# EAGLE design flying-blind-tvc (EAGLE 9.7.0)
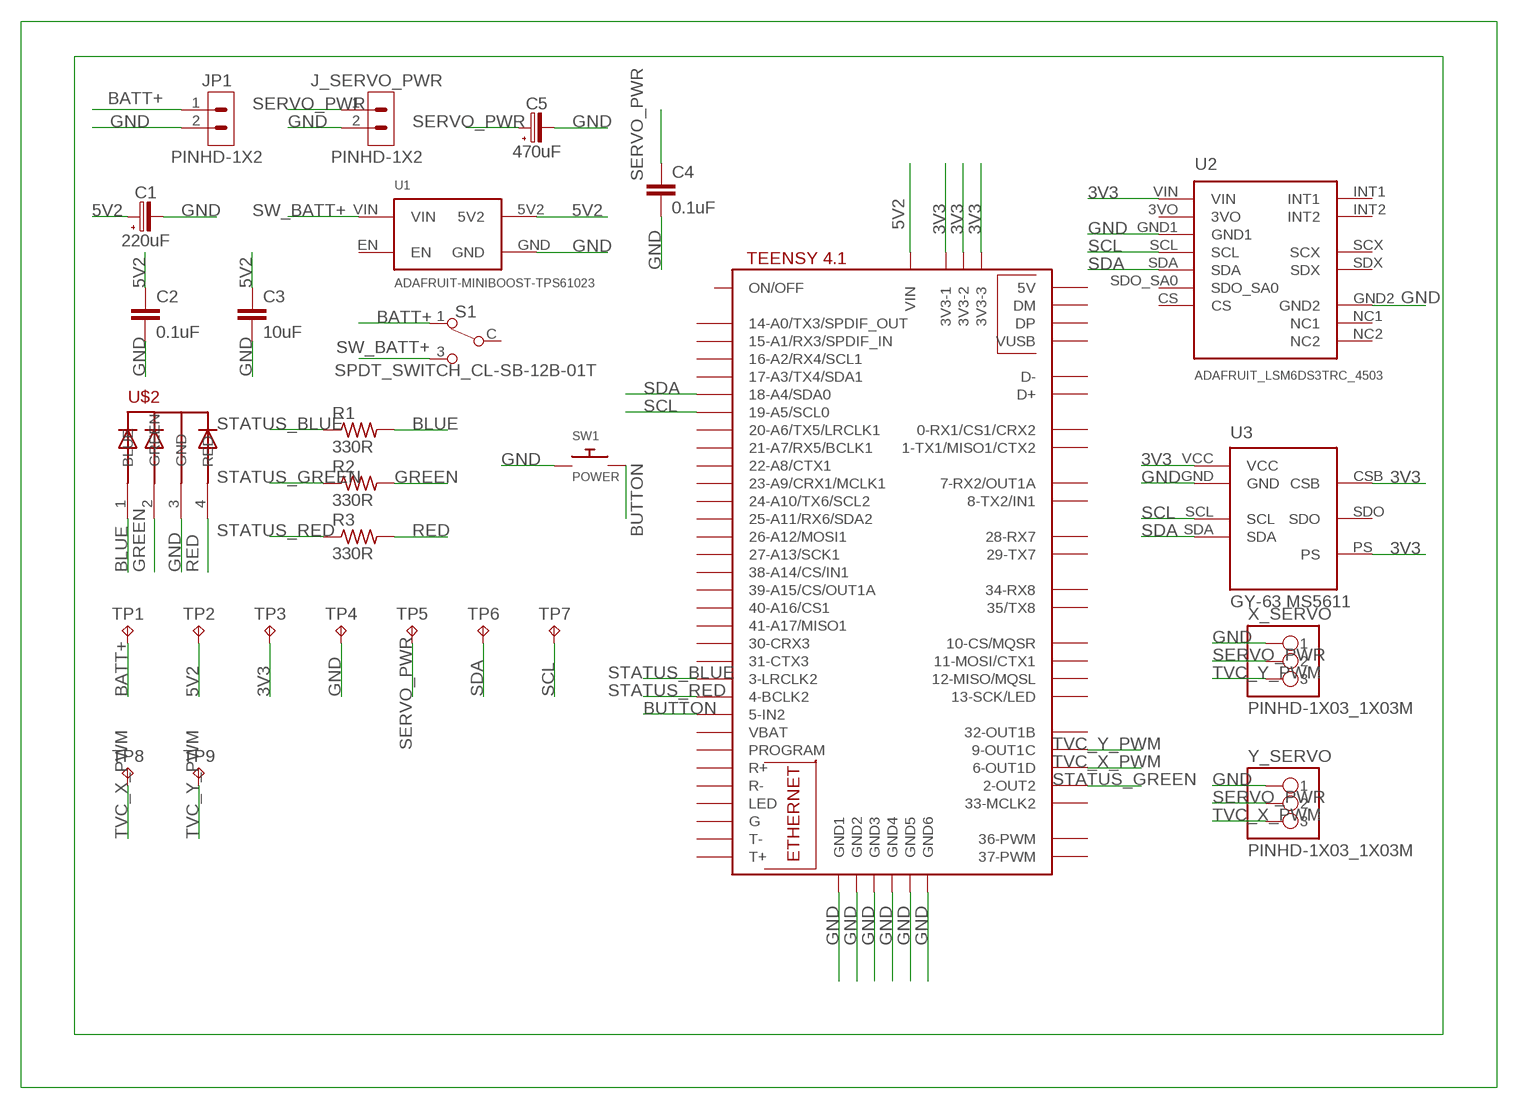
[diagram p0: schematic, sheet 1]

## Parts
C1  220uF  C-POLRADIAL-6.3MM-DIA  [CAPPRD250W80D630H800B]
C2  0.1uF  0.1UF-0402-16V-10%  [0402]
C3  10uF  10UF-0603-6.3V-20%  [0603]
C4  0.1uF  0.1UF-0402-16V-10%  [0402]
C5  470uF  C-POLRADIAL-6.3MM-DIA  [CAPPRD250W80D630H800B]
J_SERVO_PWR  PINHD-1X2  [1X02]
JP1  PINHD-1X2  [1X02]
R1  330R  R-US_R0805  [R0805]
R2  330R  R-US_R0805  [R0805]
R3  330R  R-US_R0805  [R0805]
S1  SPDT_SWITCH_CL-SB-12B-01T  [CL-SB-12B-01T]
SW1  POWER  SWITCH_PUSHBUTTONEVQ-PE  [TACT_PANA-EVQ]
TP1  TPTP127R  [TP127R]
TP2  TPTP127R  [TP127R]
TP3  TPTP127R  [TP127R]
TP4  TPTP127R  [TP127R]
TP5  TPTP127R  [TP127R]
TP6  TPTP127R  [TP127R]
TP7  TPTP127R  [TP127R]
TP8  TPTP127R  [TP127R]
TP9  TPTP127R  [TP127R]
U1  ADAFRUIT-MINIBOOST-TPS61023  [ADAFRUIT-MINIBOOST-TPS61023]
U2  ADAFRUIT_LSM6DS3TRC_4503  [ADAFRUIT_LSM6DS3TRC_4503]
U3  GY-63 MS5611  GY-63-MS5611  [GY-63-MS5611-7P]
U$1  TEENSY41  [TEENSY41]
U$2  5MMRGBLED  [LED5MMRGB]
X_SERVO  PINHD-1X03_1X03M  [1X03]
Y_SERVO  PINHD-1X03_1X03M  [1X03]

## Nets
3V3: TP3.TP U2.VIN U3.CSB U3.PS U3.VCC U$1.3V3-1 U$1.3V3-2 U$1.3V3-3
5V2: C1.1(+) C2.1 C3.1 TP2.TP U1.5V2 U$1.VIN
BATT+: JP1.1 S1.1(NC) TP1.TP
BLUE: R1.2 U$2.1(BLUE)
BUTTON: SW1.P$2 U$1.5-IN2
GND: C1.2(-) C2.2 C3.2 C4.2 C5.2(-) J_SERVO_PWR.2 JP1.2 SW1.P$1 TP4.TP U1.GND U2.GND1 U2.GND2 U3.GND U$1.GND1 U$1.GND2 U$1.GND3 U$1.GND4 U$1.GND5 U$1.GND6 U$2.3(GND) X_SERVO.1 Y_SERVO.1
GREEN: R2.2 U$2.2(GREEN)
RED: R3.2 U$2.4(RED)
SCL: TP7.TP U2.SCL U3.SCL U$1.19-A5/SCL0
SDA: TP6.TP U2.SDA U3.SDA U$1.18-A4/SDA0
SERVO_PWR: C4.1 C5.1(+) J_SERVO_PWR.1 TP5.TP X_SERVO.2 Y_SERVO.2
STATUS_BLUE: R1.1 U$1.3-LRCLK2
STATUS_GREEN: R2.1 U$1.2-OUT2
STATUS_RED: R3.1 U$1.4-BCLK2
SW_BATT+: S1.3(NO) U1.VIN
TVC_X_PWM: TP8.TP U$1.6-OUT1D Y_SERVO.3
TVC_Y_PWM: TP9.TP U$1.9-OUT1C X_SERVO.3
Unconnected: S1.C(COM) U1.EN U2.3VO U2.CS U2.INT1 U2.INT2 U2.NC1 U2.NC2 U2.SCX U2.SDO_SA0 U2.SDX U3.SDO U$1.0-RX1/CS1/CRX2 U$1.1-TX1/MISO1/CTX2 U$1.7-RX2/OUT1A U$1.8-TX2/IN1 U$1.10-CS\MQSR(10-CS/MQSR) U$1.11-MOSI/CTX1 U$1.12-MISO/MQSL U$1.13-SCK/LED U$1.14-A0/TX3/SPDIF_OUT U$1.15-A1/RX3/SPDIF_IN U$1.16-A2/RX4/SCL1 U$1.17-A3/TX4/SDA1 U$1.20-A6/TX5/LRCLK1 U$1.21-A7/RX5/BCLK1 U$1.22-A8/CTX1 U$1.23-A9/CRX1/MCLK1 U$1.24-A10/TX6/SCL2 U$1.25-A11/RX6/SDA2 U$1.26-A12/MOSI1 U$1.27-A13/SCK1 U$1.28-RX7 U$1.29-TX7 U$1.30-CRX3 U$1.31-CTX3 U$1.32-OUT1B U$1.33-MCLK2 U$1.34-RX8 U$1.35-TX8(35/TX8) U$1.36-PWM U$1.37-PWM U$1.38-A14/CS/IN1 U$1.39-A15/CS/OUT1A U$1.40-A16/CS1 U$1.41-A17/MISO1 U$1.+5V(5V) U$1.D+ U$1.D- U$1.DM U$1.DP U$1.G U$1.LED U$1.ON/OFF U$1.PROGRAM U$1.R+ U$1.R- U$1.T+ U$1.T- U$1.VBAT U$1.VUSB

## Library data of the parts
C1 C5 = Capacitor:C-POL: Capacitor Polarised - Generic
C2 C4 = SparkFun-Capacitors:0.1UF: 0.1µF ceramic capacitors A capacitor is a passive two-terminal electrical component used to store electrical energy temporarily in an electric field.
C3 = SparkFun-Capacitors:10UF: 10.0µF ceramic capacitors A capacitor is a passive two-terminal electrical component used to store electrical energy temporarily in an electric field.
J_SERVO_PWR JP1 = Connector:PINHD-1X2: Pin Header
R1-R3 = adafruit:R-US_: RESISTOR, American symbol
S1 = Switch:SPDT_SWITCH: SPDT Switches
SW1 = adafruit:SWITCH_PUSHBUTTON: Buttons SOFTTOUCHSMD_SJ - Soft touch temporary push button (Super Junk Akihabara) Compatible with SKPMANE010 [Mouser: 688-SKPMAN] C&K_KSS = Digikey: KSS221GLFS
TP1-TP9 = PCB_Utilities:TP: Test Pad
U1 = Adafruit_MiniBoost_TPS61023_4654:ADAFRUIT-MINIBOOST-TPS61023: Adafruit MiniBoost 5.2V @ 1A TPS61023, Product 4654. Carrier-module device.
U2 = FlyingBlind_Adafruit_LSM6DS3TRC_4503:ADAFRUIT_LSM6DS3TRC_4503: Adafruit LSM6DS3TR-C 6-DoF breakout module (#4503). Footprint dimensions and header locations derived from supplied official Eagle board. JP2 NC1/NC2 are physical unconnected holes in the supplied board design.
U3 = GY-63_MS5611:GY-63-MS5611: GY-63 breakout using the MS5611 pressure sensor. Header order: VCC, GND, SCL, SDA, CSB, SDO, PS.
U$1 = teensy:TEENSY41
U$2 = adafruit:5MMRGBLED
X_SERVO Y_SERVO = Tinkercad:PINHD-1X03

## Board
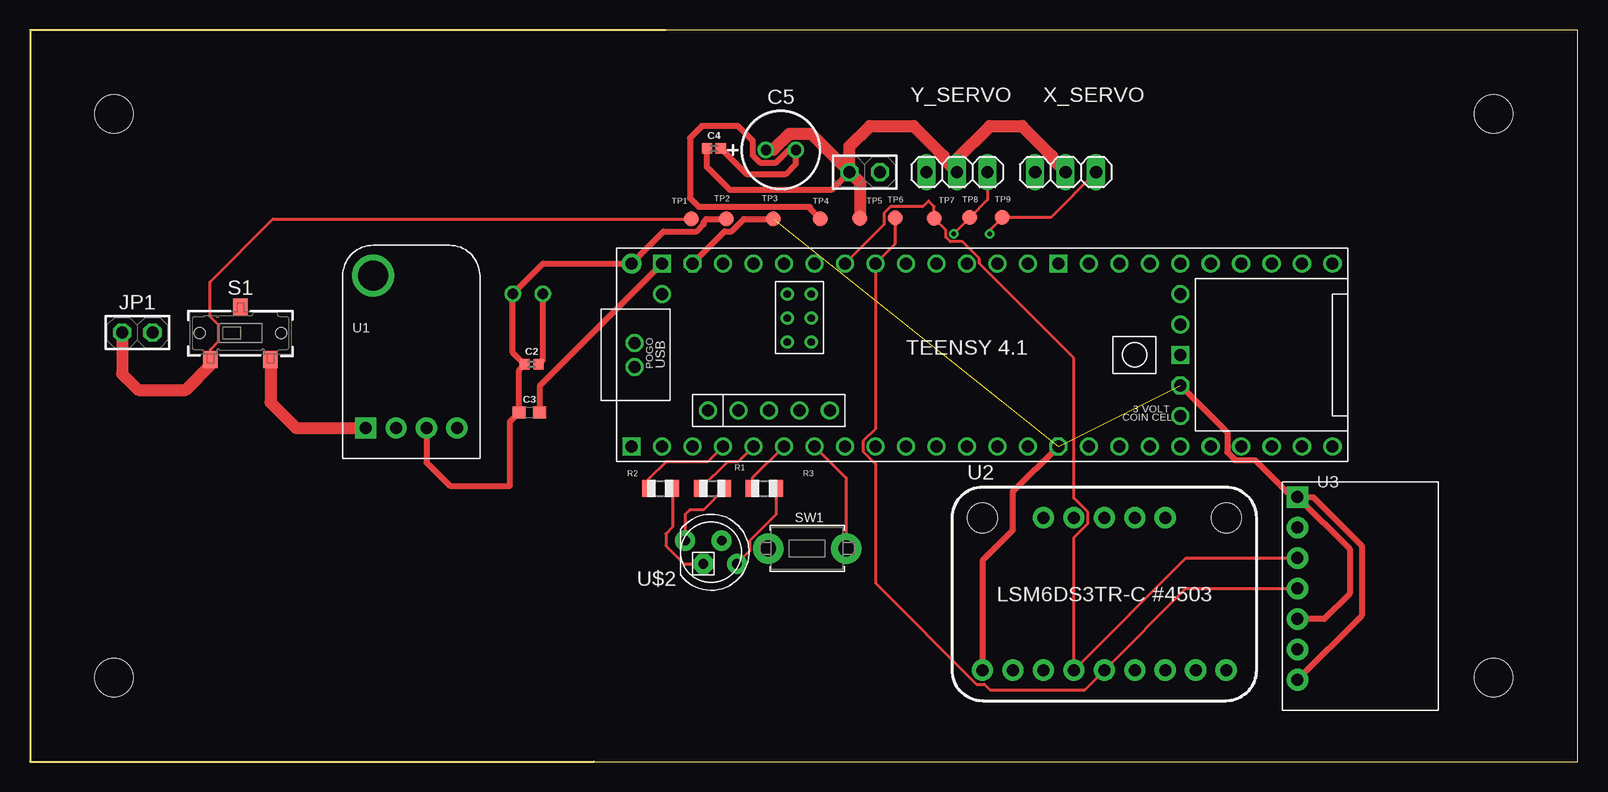
[diagram p1: board, top side]
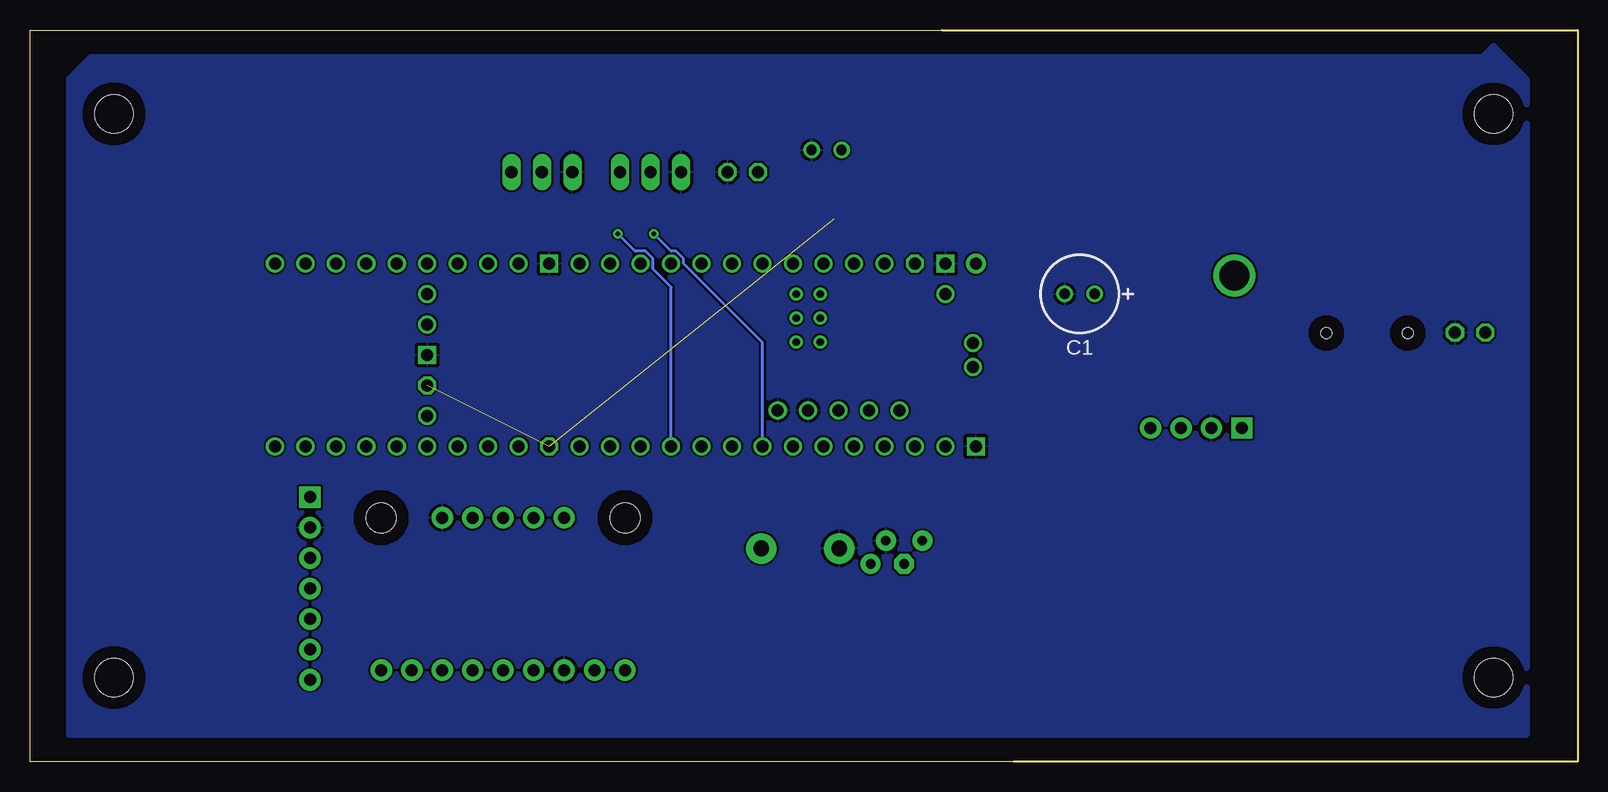
[diagram p2: board, bottom side, seen from below]

Size 129 x 61 mm. Coordinates in mm from the lower left corner, seen from the top.
Outline: 47,0 129,0 129,61 53,61 0,61 0,0 47,0
Copper layers (1*16): Top / Bottom
Stack-up Default Layer Stack: Top SilkScreen Epoxy Ink / Top SolderMask SR:Green 0.0254mm Dk 4.3 / Top Surface Finish Lead-Free 0.02mm / Top CuFoil:007 0.035mm / Dielectric-1 User Defined 1.5mm / Bottom CuFoil:007 0.035mm / Bottom Surface Finish Lead-Free 0.02mm / Bottom SolderMask SR:Green 0.0254mm Dk 4.3 / Bottom SilkScreen Epoxy Ink
Design rules: minimum copper width 6mil, minimum drill size 0.35mm, copper clearance wire_polygon to wire_polygon 6mil, copper clearance wire_polygon to pad_smd 6mil, copper clearance wire_polygon to via 6mil, copper clearance pad_smd to pad_smd 6mil, copper clearance pad_smd to via 6mil, copper clearance via to via 6mil, copper clearance smd to pad (same net) 6mil, copper clearance smd to via (same net) 6mil, copper clearance smd to smd (same net) 6mil, restrict clearance 0mil, dimension clearance 40mil, via restrict clearance 0mil, drill distance 6mil, keepout clearance 0mil
Holes 3.2 mm at 7,54 122,54 7,7 122,7

### Footprints (pad centres in the part's own frame; a part is rotated, then mirrored left to right if it is on the bottom)
CAPPRD250W80D630H800B = drill 0.864 pad 1.372: 1 -1.25,0; 2 1.25,0
0402 = smd 0.85 x 0.9: 1 -0.58,0; 2 0.58,0
0603 = smd 1.1 x 1: 1 -0.85,0; 2 0.85,0
1X02 = drill 1.016 octagon: 1 -1.27,0; 2 1.27,0
R0805 = smd 1.1 x 1.4: 1 -1,0; 2 1,0
CL-SB-12B-01T = smd 1.2 x 1.4: 1 -2.5,-2.2; 3 2.5,-2.2; C 0,2.2 | hole 0.9: -3.4,0; 3.4,0
TACT_PANA-EVQ = drill 1.3 pad 2.54: P$1 -3.25,0; P$2 3.25,0
TP127R = smd 1.27 x 1.27: TP 0,0
ADAFRUIT-MINIBOOST-TPS61023 = drill 1 pad 1.778: 5V2 6.985,2.54; EN 9.525,2.54; GND 4.445,2.54 | drill 2.5 pad 3.5: MH 2.54,15.24 | drill 1 pad 1.778 square: VIN 1.905,2.54
ADAFRUIT_LSM6DS3TRC_4503 = drill 1 pad 1.778: 3VO 5.08,2.54; CS 17.78,2.54; GND1 7.62,2.54; GND2 17.78,15.24; INT1 20.32,2.54; INT2 22.86,2.54; NC1 15.24,15.24; NC2 12.7,15.24; SCL 10.16,2.54; SCX 7.62,15.24; SDA 12.7,2.54; SDO_SA0 15.24,2.54; SDX 10.16,15.24; VIN 2.54,2.54 | hole 2.5: 2.54,15.24; 22.86,15.24
GY-63-MS5611-7P = drill 1 pad 1.8: CSB 0,-10.16; GND 0,-2.54; PS 0,-15.24; SCL 0,-5.08; SDA 0,-7.62; SDO 0,-12.7 | drill 1 pad 1.8 square: VCC 0,0
TEENSY41 = drill 1: 0-RX1/CS1/CRX2 -27.94,-7.62; 1-TX1/MISO1/CTX2 -25.4,-7.62; 2-OUT2 -22.86,-7.62; 3-LRCLK2 -20.32,-7.62; 4-BCLK2 -17.78,-7.62; 5-IN2 -15.24,-7.62; 6-OUT1D -12.7,-7.62; 7-RX2/OUT1A -10.16,-7.62; 8-TX2/IN1 -7.62,-7.62; 9-OUT1C -5.08,-7.62; 10-CS\MQSR -2.54,-7.62; 11-MOSI/CTX1 0,-7.62; 12-MISO/MQSL 2.54,-7.62; 13-SCK/LED 2.54,7.62; 14-A0/TX3/SPDIF_OUT 0,7.62; 15-A1/RX3/SPDIF_IN -2.54,7.62; 16-A2/RX4/SCL1 -5.08,7.62; 17-A3/TX4/SDA1 -7.62,7.62; 18-A4/SDA0 -10.16,7.62; 19-A5/SCL0 -12.7,7.62; 20-A6/TX5/LRCLK1 -15.24,7.62; 21-A7/RX5/BCLK1 -17.78,7.62; 22-A8/CTX1 -20.32,7.62; 23-A9/CRX1/MCLK1 -22.86,7.62; 24-A10/TX6/SCL2 7.62,-7.62; 25-A11/RX6/SDA2 10.16,-7.62; 26-A12/MOSI1 12.7,-7.62; 27-A13/SCK1 15.24,-7.62; 28-RX7 17.78,-7.62; 29-TX7 20.32,-7.62; 30-CRX3 22.86,-7.62; 31-CTX3 25.4,-7.62; 32-OUT1B 27.94,-7.62; 33-MCLK2 27.94,7.62; 34-RX8 25.4,7.62; 35-TX8 22.86,7.62; 36-PWM 20.32,7.62; 37-PWM 17.78,7.62; 38-A14/CS/IN1 15.24,7.62; 39-A15/CS/OUT1A 12.7,7.62; 40-A16/CS1 10.16,7.62; 41-A17/MISO1 7.62,7.62; +5V -24.13,-4.62; D+ -30.25,-1; D- -30.25,1; DM -21.59,-4.62; DP -19.05,-4.62; GND4 -16.51,-4.62; GND5 -13.97,-4.62; ON/OFF 15.24,5.08; PROGRAM 15.24,2.54; VBAT 15.24,-5.08; VUSB -27.94,5.08 | drill 1 octagon: 3V3-1 5.08,-7.62; 3V3-2 15.24,-2.54; 3V3-3 -25.4,7.62 | drill 0.6: G -15.51,3.08; LED -17.51,3.08; R+ -17.51,5.08; R- -15.51,5.08; T+ -15.51,1.08; T- -17.51,1.08 | drill 1 square: GND1 -30.48,-7.62; GND2 15.24,0; GND3 5.08,7.62; GND6 -27.94,7.62 | drill 1 pad 1.676: VIN -30.48,7.62
LED5MMRGB = drill 0.8 pad 1.676: 1 -2.159,0.968; 3 0.889,0.968; 4 2.159,-0.968 | drill 0.8 pad 1.676 octagon: 2 -0.635,-0.968
1X03 = drill 1.016 long: 1 -2.54,0; 2 0,0; 3 2.54,0

### Placement (x,y rotation side)
C1  41.49,38.99 180 bottom
C2  41.82,33.12 0 top
C3  41.63,29.12 0 top
C4  57.01,51.12 0 top
C5  62.6,50.99 0 top
J_SERVO_PWR  69.58,49.15 0 top
JP1  8.95,35.77 0 top
R1  56.9,22.77 0 top
R2  52.55,22.77 0 top
R3  61.2,22.77 0 top
S1  17.55,35.72 0 top
SW1  64.79,17.77 0 top
TP1  55.12,45.23 0 top
TP2  58.04,45.23 0 top
TP3  61.96,45.23 0 top
TP4  65.88,45.23 0 top
TP5  69.17,45.29 0 top
TP6  72.11,45.34 0 top
TP7  75.37,45.29 0 top
TP8  78.34,45.36 0 top
TP9  81.06,45.37 0 top
U1  26.07,25.27 0 top
U2  76.86,5.08 0 top
U3  105.66,22.05 0 top
U$1  80.64,33.91 0 top
U$2  56.77,17.45 0 top
X_SERVO  86.33,49.15 0 top
Y_SERVO  77.28,49.15 0 top

### Tracks (layer width: path | path; a pad name or v marks a point on that pad's centre or on a via)
3V3  (2 unrouted)
  Top 0.5: U$1.3V3-1 81.92,22.48 81.92,19.28 79.4,16.76 U2.VIN | U3.VCC 105.2,22.05 102.12,25.13 100.48,25.13 99.8,25.81 99.8,27.44 U$1.3V3-2 | 106.66,21.05 U3.VCC | U3.VCC 110,17.71 110,14 107.89,11.89 U3.CSB | U3.VCC 106.95,22.05 111,18 111,12.15 U3.PS | U$1.3V3-3 57.91,44.19 58.47,44.19 59.51,45.23 TP3.TP
5V2
  Top 0.5: U1.5V2 33.05,24.95 35,23 40,23 40,28.34 C3.1 40.78,32.66 C2.1 40.24,34.12 C1.1 42.78,41.53 U$1.VIN 52.83,44.19 55.55,44.19 56.16,44.8 56.16,45 56.39,45.23 TP2.TP
BATT+
  Top 0.25: S1.1 15.05,34.37 15.74,35.06 15.74,36.38 15,37.12 15,40 20.23,45.23 TP1.TP
  Top 1: JP1.1 7.68,32.32 9,31 13,31 15.05,33.05 S1.1
BLUE
  Top 0.25: R1.2 56.13,21 55,21 54.61,20.61 U$2.1
BUTTON
  Top 0.25: U$1.5-IN2 68.04,23.65 SW1.P$2
GND
  Top 0.5: TP4.TP 65,46.11 65,46.27 55.73,46.27 55,47 55,52 56,53 59,53 60.26,51.74 60.26,50.54 60.9,49.9 62.14,49.9 63.23,50.99 C5.2 63.85,49.85 63,49 59.71,49 C4.2 | C1.2 42.74,33.46 C2.2 | U$1.GND6 42.48,31.31 C3.2
  pour Bottom: 8,59 124,59 126,57 126,2 4,2 4,57 7,60
GREEN
  Top 0.25: R2.2 53.55,19.55 53,19 53,18 54.52,16.48 U$2.2
RED
  Top 0.25: U$2.4 59.99,17.55 59.99,18.41 62.2,20.62 R3.2
SCL
  Top 0.25: U$1.19-A5/SCL0 71.2,44.79 71.2,45.72 71.74,46.25 74.42,46.25 74.92,46.75 75.37,46.29 TP7.TP 76.34,44.32 76.34,43.73 76.73,43.34 77.74,43.34 79.13,41.95 79.13,41.53 87.02,33.64 87.02,21.97 88.19,20.8 88.19,19.84 87.02,18.67 U2.SCL 96.37,16.97 U3.SCL
SDA
  Top 0.25: U3.SDA 96.37,14.43 U2.SDA 87.94,6 80,6 79.55,6.45 78.92,6.45 70.48,14.89 70.48,24.83 69.45,25.86 69.45,26.71 70.48,27.74 U$1.18-A4/SDA0 72.11,43.16 TP6.TP
SERVO_PWR
  Top 0.5: C4.1 56.43,49.57 58.35,47.65 66.81,47.65 J_SERVO_PWR.1
  Top 1: J_SERVO_PWR.1 68.31,51.31 70,53 73.65,53 76.15,50.5 76.15,50.28 Y_SERVO.2 77.28,50.28 80,53 82.7,53 85.2,50.5 85.2,50.28 X_SERVO.2 | C5.1 61.96,50.99 63.3,52.33 65.13,52.33 J_SERVO_PWR.1 | J_SERVO_PWR.1 69.17,48.29 TP5.TP
STATUS_BLUE
  Top 0.25: U$1.3-LRCLK2 59.03,25 58.13,25 R1.1
STATUS_GREEN
  Top 0.25: U$1.2-OUT2 56.49,25 53,25 51.55,23.55 R2.1
STATUS_RED
  Top 0.25: U$1.4-BCLK2 60.2,23.63 R3.1
SW_BATT+
  Top 1: S1.3 20.05,29.95 22.19,27.81 U1.VIN
TVC_X_PWM  (via drill 0.35)
  Top 0.25: Y_SERVO.3 79.82,46.83 TP8.TP 77,44.02 v77,44
  Bottom 0.25: U$1.6-OUT1D 67.94,34.94 74.53,41.53 74.53,41.95 75.13,42.56 75.56,42.56 v77,44
TVC_Y_PWM  (via drill 0.35)
  Top 0.25: X_SERVO.3 85.09,45.37 TP9.TP 80,44.32 v80,44
  Bottom 0.25: U$1.9-OUT1C 75.56,39.56 77.07,41.07 77.07,41.95 77.67,42.56 78.56,42.56 v80,44